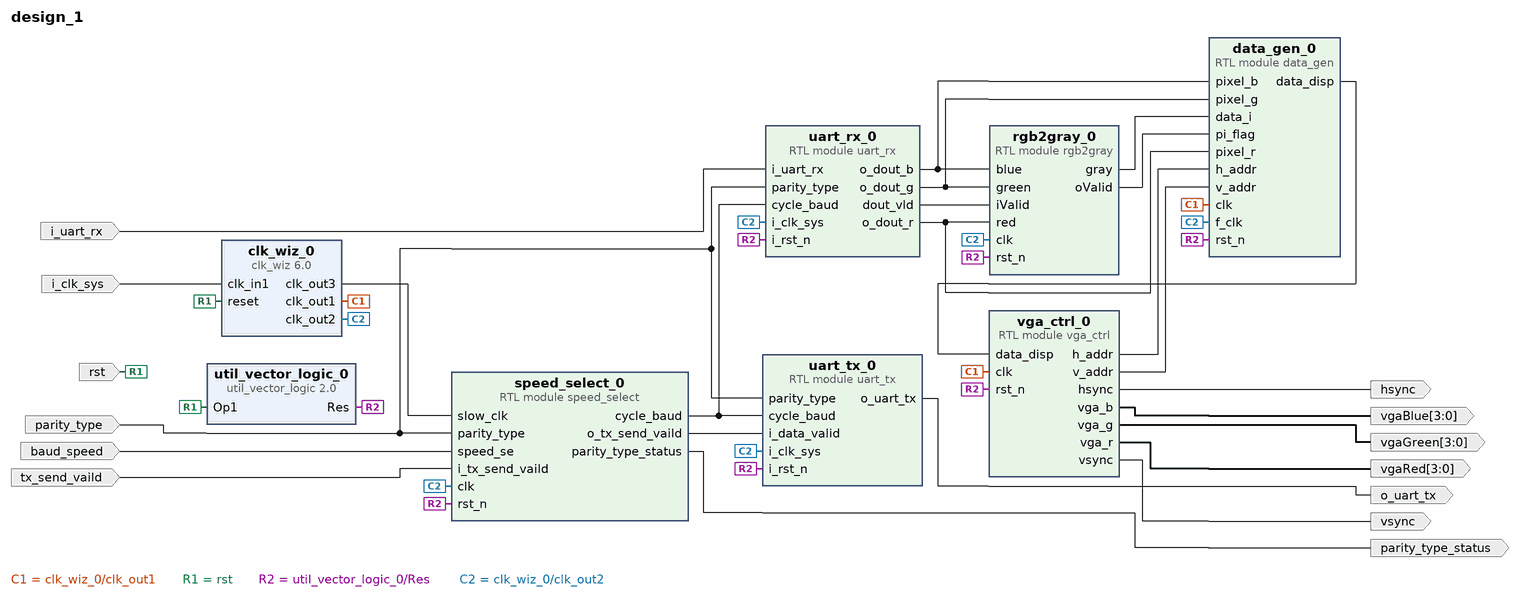
[diagram p0: block diagram of the top level]
# Vivado block design design_1, xc7a35tcpg236-1, Vivado 2018.3
create_bd_design design_1

create_bd_port -dir I -type clk i_clk_sys
set_property -dict {CONFIG.FREQ_HZ 100000000} [get_bd_ports i_clk_sys]
create_bd_port -dir I -type rst rst
set_property -dict {CONFIG.POLARITY ACTIVE_HIGH} [get_bd_ports rst]
create_bd_port -dir I -type data i_uart_rx
create_bd_port -dir I -type data baud_speed
create_bd_port -dir I parity_type
create_bd_port -dir O -from 3 -to 0 -type data vgaRed
create_bd_port -dir O -from 3 -to 0 vgaBlue
create_bd_port -dir O -from 3 -to 0 vgaGreen
create_bd_port -dir O hsync
create_bd_port -dir O -type data vsync
create_bd_port -dir O parity_type_status
create_bd_port -dir O -type data o_uart_tx
create_bd_port -dir I tx_send_vaild

create_bd_cell -type module -reference vga_ctrl vga_ctrl_0
create_bd_cell -type ip -vlnv xilinx.com:ip:clk_wiz:6.0 clk_wiz_0
set_property -dict [list \
  CONFIG.CLKOUT1_DRIVES BUFG \
  CONFIG.CLKOUT1_JITTER 183.467 \
  CONFIG.CLKOUT1_PHASE_ERROR 105.461 \
  CONFIG.CLKOUT1_REQUESTED_OUT_FREQ 25 \
  CONFIG.CLKOUT2_DRIVES BUFG \
  CONFIG.CLKOUT2_JITTER 137.681 \
  CONFIG.CLKOUT2_PHASE_ERROR 105.461 \
  CONFIG.CLKOUT2_USED true \
  CONFIG.CLKOUT3_DRIVES BUFG \
  CONFIG.CLKOUT3_JITTER 219.371 \
  CONFIG.CLKOUT3_PHASE_ERROR 105.461 \
  CONFIG.CLKOUT3_REQUESTED_OUT_FREQ 10 \
  CONFIG.CLKOUT3_USED true \
  CONFIG.CLKOUT4_DRIVES BUFG \
  CONFIG.CLKOUT5_DRIVES BUFG \
  CONFIG.CLKOUT6_DRIVES BUFG \
  CONFIG.CLKOUT7_DRIVES BUFG \
  CONFIG.MMCM_CLKFBOUT_MULT_F 9 \
  CONFIG.MMCM_CLKOUT0_DIVIDE_F 36 \
  CONFIG.MMCM_CLKOUT1_DIVIDE 9 \
  CONFIG.MMCM_CLKOUT2_DIVIDE 90 \
  CONFIG.MMCM_COMPENSATION ZHOLD \
  CONFIG.MMCM_DIVCLK_DIVIDE 1 \
  CONFIG.NUM_OUT_CLKS 3 \
  CONFIG.PRIMITIVE PLL \
] [get_bd_cells clk_wiz_0]
create_bd_cell -type ip -vlnv xilinx.com:ip:util_vector_logic:2.0 util_vector_logic_0
set_property -dict {CONFIG.C_OPERATION not CONFIG.C_SIZE 1} [get_bd_cells util_vector_logic_0]
create_bd_cell -type module -reference speed_select speed_select_0
create_bd_cell -type module -reference uart_tx uart_tx_0
create_bd_cell -type module -reference rgb2gray rgb2gray_0
create_bd_cell -type module -reference uart_rx uart_rx_0
create_bd_cell -type module -reference data_gen data_gen_0

# ---- connections ----

connect_bd_net [get_bd_pins speed_select_0/cycle_baud] [get_bd_pins uart_tx_0/cycle_baud] [get_bd_pins uart_rx_0/cycle_baud]
connect_bd_net -net uart_rx_0_o_uart_data [get_bd_pins rgb2gray_0/gray] [get_bd_pins data_gen_0/data_i]
connect_bd_net [get_bd_pins vga_ctrl_0/h_addr] [get_bd_pins data_gen_0/h_addr]
connect_bd_net [get_bd_pins vga_ctrl_0/v_addr] [get_bd_pins data_gen_0/v_addr]
connect_bd_net [get_bd_pins data_gen_0/data_disp] [get_bd_pins vga_ctrl_0/data_disp]
connect_bd_net [get_bd_pins clk_wiz_0/clk_out1] [get_bd_pins vga_ctrl_0/clk] [get_bd_pins data_gen_0/clk]
connect_bd_net [get_bd_ports rst] [get_bd_pins clk_wiz_0/reset] [get_bd_pins util_vector_logic_0/Op1]
connect_bd_net [get_bd_pins util_vector_logic_0/Res] \
  [get_bd_pins vga_ctrl_0/rst_n] [get_bd_pins speed_select_0/rst_n] [get_bd_pins uart_tx_0/i_rst_n] \
  [get_bd_pins rgb2gray_0/rst_n] [get_bd_pins uart_rx_0/i_rst_n] [get_bd_pins data_gen_0/rst_n]
connect_bd_net -net rx_1 [get_bd_ports i_uart_rx] [get_bd_pins uart_rx_0/i_uart_rx]
connect_bd_net [get_bd_ports baud_speed] [get_bd_pins speed_select_0/speed_se]
connect_bd_net [get_bd_ports parity_type] \
  [get_bd_pins speed_select_0/parity_type] [get_bd_pins uart_tx_0/parity_type] [get_bd_pins uart_rx_0/parity_type]
connect_bd_net [get_bd_pins vga_ctrl_0/vga_r] [get_bd_ports vgaRed]
connect_bd_net [get_bd_pins vga_ctrl_0/vga_g] [get_bd_ports vgaGreen]
connect_bd_net [get_bd_pins vga_ctrl_0/vga_b] [get_bd_ports vgaBlue]
connect_bd_net [get_bd_pins vga_ctrl_0/hsync] [get_bd_ports hsync]
connect_bd_net [get_bd_pins vga_ctrl_0/vsync] [get_bd_ports vsync]
connect_bd_net [get_bd_pins speed_select_0/parity_type_status] [get_bd_ports parity_type_status]
connect_bd_net [get_bd_ports i_clk_sys] [get_bd_pins clk_wiz_0/clk_in1]
connect_bd_net [get_bd_pins clk_wiz_0/clk_out2] \
  [get_bd_pins speed_select_0/clk] [get_bd_pins uart_tx_0/i_clk_sys] [get_bd_pins rgb2gray_0/clk] \
  [get_bd_pins uart_rx_0/i_clk_sys] [get_bd_pins data_gen_0/f_clk]
connect_bd_net [get_bd_pins uart_tx_0/o_uart_tx] [get_bd_ports o_uart_tx]
connect_bd_net [get_bd_pins clk_wiz_0/clk_out3] [get_bd_pins speed_select_0/slow_clk]
connect_bd_net [get_bd_ports tx_send_vaild] [get_bd_pins speed_select_0/i_tx_send_vaild]
connect_bd_net [get_bd_pins speed_select_0/o_tx_send_vaild] [get_bd_pins uart_tx_0/i_data_valid]
connect_bd_net [get_bd_pins rgb2gray_0/oValid] [get_bd_pins data_gen_0/pi_flag]
connect_bd_net [get_bd_pins uart_rx_0/dout_vld] [get_bd_pins rgb2gray_0/iValid]
connect_bd_net [get_bd_pins uart_rx_0/o_dout_b] [get_bd_pins rgb2gray_0/blue] [get_bd_pins data_gen_0/pixel_b]
connect_bd_net [get_bd_pins uart_rx_0/o_dout_g] [get_bd_pins rgb2gray_0/green] [get_bd_pins data_gen_0/pixel_g]
connect_bd_net [get_bd_pins uart_rx_0/o_dout_r] [get_bd_pins rgb2gray_0/red] [get_bd_pins data_gen_0/pixel_r]

validate_bd_design
save_bd_design
